# Altium project PIR.PrjPcb
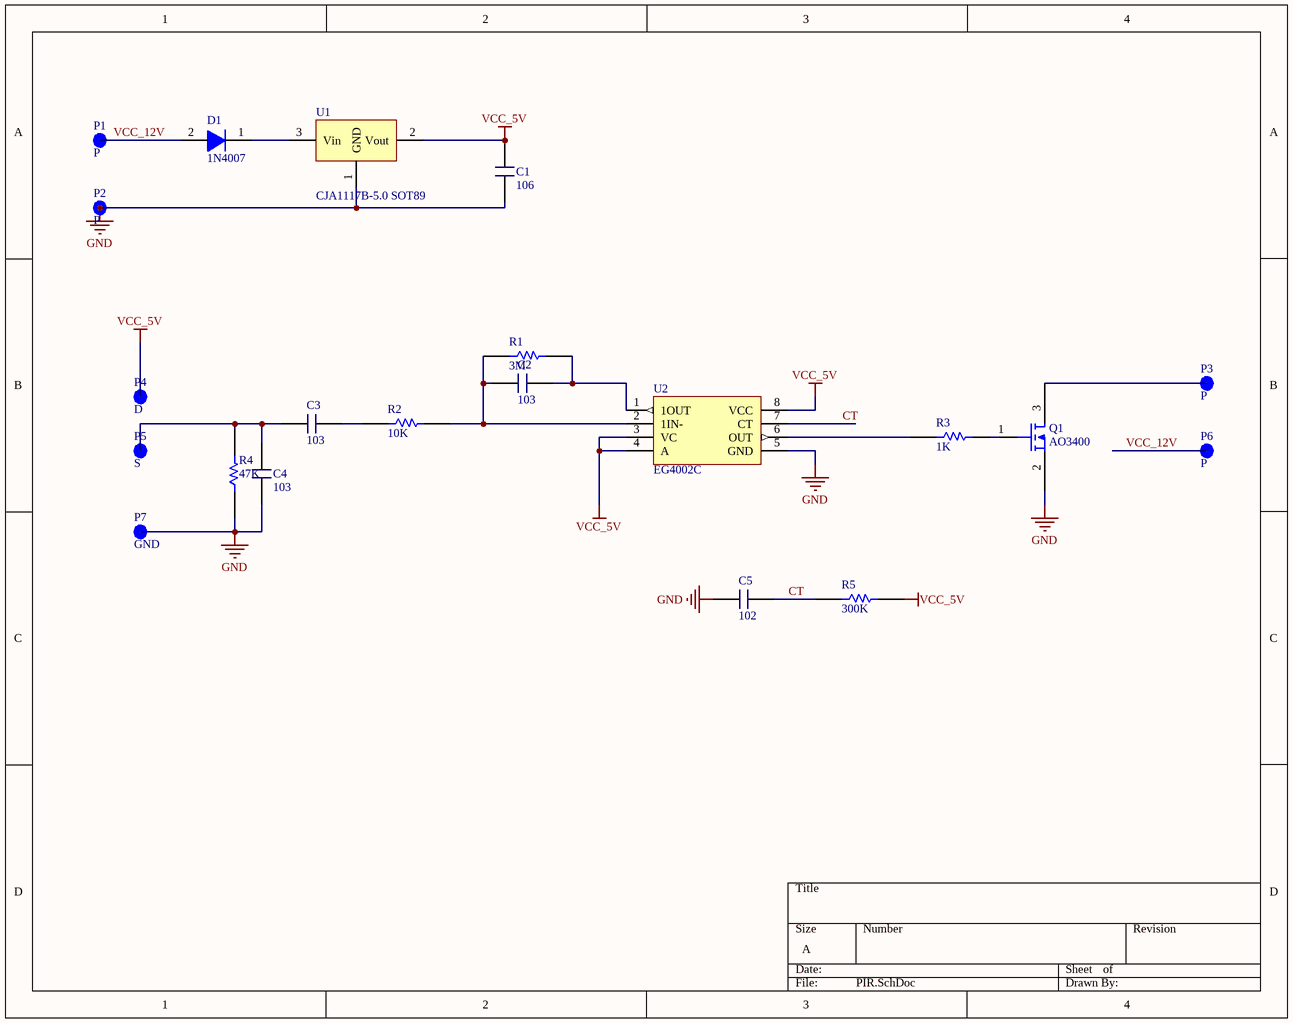
[diagram p0: PIR.SchDoc]
1 sheet, 21 parts. Net scope: global (net labels, ports and power ports of the same name join across sheets).
Board file: PIR.PcbDoc

## Sheet PIR.SchDoc
size A

### Parts
C1  106  [CAPC2012X12N]
C2  103  [CAPC2012X12N]
C3  103  [CAPC2012X12N]
C4  103  [CAPC2012X12N]
C5  102  [CAPC2012X12N]
D1  1N4007  [SODFL504X244-2N]
P1  P  [Point]
P2  P  [Point]
P3  P  [Point]
P4  D  [Point]
P5  S  [Point]
P6  P  [Point]
P7  GND  [Point]
Q1  AO3400  [SOT95P278X125-3N]
R1  3M  [RESC2608X06N_0603]
R2  10K  [RESC2608X06N_0603]
R3  1K  [RESC2608X06N_0603]
R4  47K  [RESC2608X06N_0603]
R5  300K  [RESC2608X06N_0603]
U1  CJA1117B-5.0 SOT89  [SOT89-150P409X160-3N]
U2  EG4002C  [TSOP127P620X155-8N]

### Nets
GND: C1.1 C4.1 C5.1 P2.1 P7.1 Q1.2(S) R4.1 U1.1(GND) U2.5(GND)
VCC_5V: C1.2 P4.1 R5.2 U1.2(Vout) U2.3(VC) U2.4(A) U2.8(VCC)
CT: C5.2 R5.1 U2.7(CT)
VCC_12V: D1.2(A) P1.1 P6.1
NetC2_1: C2.1 R1.1 R2.2 U2.2(1IN-)
NetC2_2: C2.2 R1.2 U2.1(1OUT)
NetC3_1: C3.1 R2.1
NetC3_2: C3.2 C4.2 P5.1 R4.2
NetD1_1: D1.1(C) U1.3(Vin)
NetP3_1: P3.1 Q1.3(D)
NetQ1_1: Q1.1(G) R3.2
NetR3_1: R3.1 U2.6(OUT)

### Library data of the parts
C1 = Capacitor 106
C2-C4 = Capacitor 103 0603
C5 = Capacitor 102 0603
D1 = 1N4007_SMD Diode: 1N4007_SMD
P1-P7 = Point
Q1 = AO3400  MOSFET SOT23-3
R1 = 3M_0603_5%: Thick Film Resistors - SMD 0603 3MOHMS 5% 1/10WATT; Supplier 1: Digi-Key; Supplier Part Number 1: CR0603-JW-101ELFCT-ND
R2 = R10k_0603_5%: RES SMD 10K OHM 1% 1/4W 0603; Supplier 1: Digi-Key; Supplier Part Number 1: 541-10.0KSCT-ND
R3 = 1k_0603_5%: Thick Film Resistors - SMD 0603 1kOHMS 5% 1/10WATT; Supplier 1: Digi-Key; Supplier Part Number 1: CR0603-JW-101ELFCT-ND
R4 = 47k_0603_5%: Thick Film Resistors - SMD 0603 47kOHMS 5% 1/10WATT; Supplier 1: Digi-Key; Supplier Part Number 1: CR0603-JW-101ELFCT-ND
R5 = 300k_0603_5%: Thick Film Resistors - SMD 0603 300kOHMS 5% 1/10WATT; Supplier 1: Digi-Key; Supplier Part Number 1: CR0603-JW-101ELFCT-ND
U1 = CJA1117B-5.0 SOT89: CJA1117B-5.0 SOT89 Power IC 1A 5V_IC
U2 = EG4002C: IC PIR CONTROLLER8SOIC; Supplier 1: Digi-Key; Supplier Part Number 1: MAX485CSA+-ND